# Altium schematic sheet pay-led-pcb.SchDoc: PAY-LED
size A4; DrawnBy: Lorna Lan; Organization: UTAT; DocumentNumber: PL01; Revision: 3; SheetNumber: 1; SheetTotal: 1
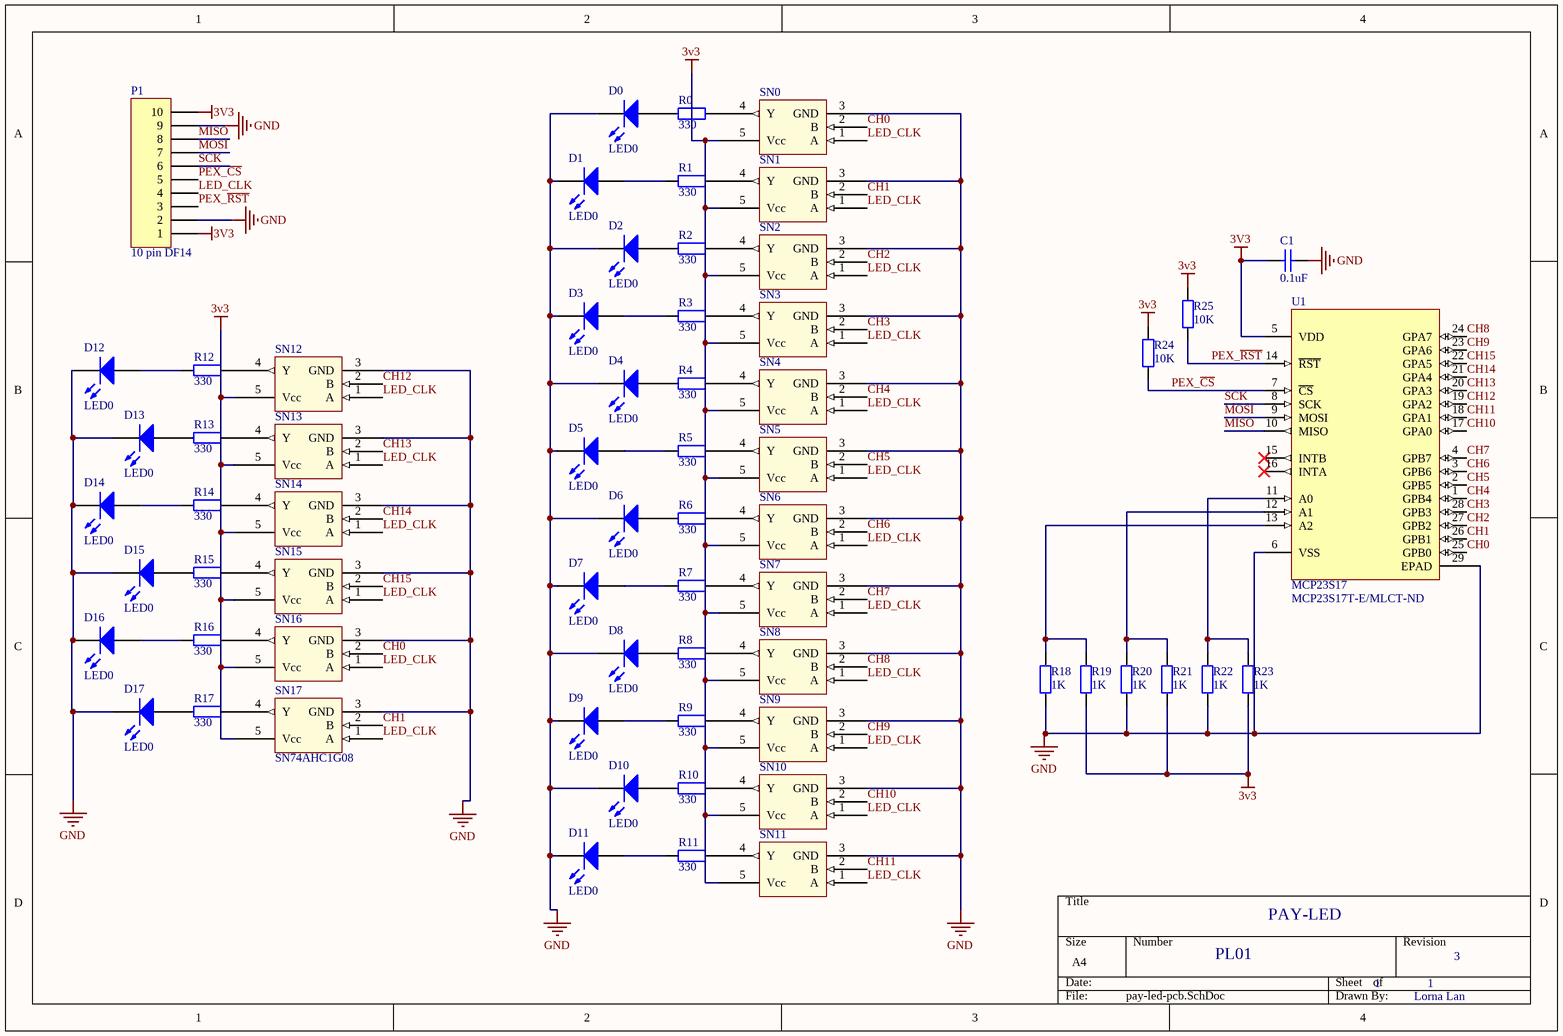
[diagram p0: pay-led-pcb.SchDoc]

## Parts
C1  0.1uF  [1608[0603]]
D0  LED0  [LB P4SG]
D1  LED0  [LB P4SG]
D2  LED0  [LB P4SG]
D3  LED0  [LB P4SG]
D4  LED0  [LB P4SG]
D5  LED0  [LB P4SG]
D6  LED0  [LB P4SG]
D7  LED0  [LB P4SG]
D8  LED0  [LB P4SG]
D9  LED0  [LB P4SG]
D10  LED0  [LB P4SG]
D11  LED0  [LB P4SG]
D12  LED0  [LB P4SG]
D13  LED0  [LB P4SG]
D14  LED0  [LB P4SG]
D15  LED0  [LB P4SG]
D16  LED0  [LB P4SG]
D17  LED0  [LB P4SG]
P1  10 pin DF14  [DF14-10P-1.25H(55)]
R0  330  [J1-0603]
R1  330  [J1-0603]
R2  330  [J1-0603]
R3  330  [J1-0603]
R4  330  [J1-0603]
R5  330  [J1-0603]
R6  330  [J1-0603]
R7  330  [J1-0603]
R8  330  [J1-0603]
R9  330  [J1-0603]
R10  330  [J1-0603]
R11  330  [J1-0603]
R12  330  [J1-0603]
R13  330  [J1-0603]
R14  330  [J1-0603]
R15  330  [J1-0603]
R16  330  [J1-0603]
R17  330  [J1-0603]
R18  1K  [J1-0603]
R19  1K  [J1-0603]
R20  1K  [J1-0603]
R21  1K  [J1-0603]
R22  1K  [J1-0603]
R23  1K  [J1-0603]
R24  10K  [J1-0603]
R25  10K  [J1-0603]
SN0  SN74AHC1G08  [SOT-23-5_95P290X160-5N]  (value not drawn)
SN1  SN74AHC1G08  [SOT-23-5_95P290X160-5N]  (value not drawn)
SN2  SN74AHC1G08  [SOT-23-5_95P290X160-5N]  (value not drawn)
SN3  SN74AHC1G08  [SOT-23-5_95P290X160-5N]  (value not drawn)
SN4  SN74AHC1G08  [SOT-23-5_95P290X160-5N]  (value not drawn)
SN5  SN74AHC1G08  [SOT-23-5_95P290X160-5N]  (value not drawn)
SN6  SN74AHC1G08  [SOT-23-5_95P290X160-5N]  (value not drawn)
SN7  SN74AHC1G08  [SOT-23-5_95P290X160-5N]  (value not drawn)
SN8  SN74AHC1G08  [SOT-23-5_95P290X160-5N]  (value not drawn)
SN9  SN74AHC1G08  [SOT-23-5_95P290X160-5N]  (value not drawn)
SN10  SN74AHC1G08  [SOT-23-5_95P290X160-5N]  (value not drawn)
SN11  SN74AHC1G08  [SOT-23-5_95P290X160-5N]  (value not drawn)
SN12  SN74AHC1G08  [SOT-23-5_95P290X160-5N]  (value not drawn)
SN13  SN74AHC1G08  [SOT-23-5_95P290X160-5N]  (value not drawn)
SN14  SN74AHC1G08  [SOT-23-5_95P290X160-5N]  (value not drawn)
SN15  SN74AHC1G08  [SOT-23-5_95P290X160-5N]  (value not drawn)
SN16  SN74AHC1G08  [SOT-23-5_95P290X160-5N]  (value not drawn)
SN17  SN74AHC1G08  [SOT-23-5_95P290X160-5N]
U1  MCP23S17  Supplier Part Number 1: MCP23S17T-E/MLCT-ND  [QFN65P600X600X100-29N]

## Nets
3v3: C1.2 P1.1 P1.10 R19.1 R21.1 R23.1 R24.1 R25.1 SN0.5(Vcc) SN1.5(Vcc) SN2.5(Vcc) SN3.5(Vcc) SN4.5(Vcc) SN5.5(Vcc) SN6.5(Vcc) SN7.5(Vcc) SN8.5(Vcc) SN9.5(Vcc) SN10.5(Vcc) SN11.5(Vcc) SN12.5(Vcc) SN13.5(Vcc) SN14.5(Vcc) SN15.5(Vcc) SN16.5(Vcc) SN17.5(Vcc) U1.5(VDD)
GND: C1.1 D0.2(K) D1.2(K) D2.2(K) D3.2(K) D4.2(K) D5.2(K) D6.2(K) D7.2(K) D8.2(K) D9.2(K) D10.2(K) D11.2(K) D12.2(K) D13.2(K) D14.2(K) D15.2(K) D16.2(K) D17.2(K) P1.2 P1.9 R18.1 R20.1 R22.1 SN0.3(GND) SN1.3(GND) SN2.3(GND) SN3.3(GND) SN4.3(GND) SN5.3(GND) SN6.3(GND) SN7.3(GND) SN8.3(GND) SN9.3(GND) SN10.3(GND) SN11.3(GND) SN12.3(GND) SN13.3(GND) SN14.3(GND) SN15.3(GND) SN16.3(GND) SN17.3(GND) U1.6(VSS) U1.29(EPAD)
CH0: SN0.2(B) SN16.2(B) U1.25(GPB0)
CH1: SN1.2(B) SN17.2(B) U1.26(GPB1)
CH2: SN2.2(B) U1.27(GPB2)
CH3: SN3.2(B) U1.28(GPB3)
CH4: SN4.2(B) U1.1(GPB4)
CH5: SN5.2(B) U1.2(GPB5)
CH6: SN6.2(B) U1.3(GPB6)
CH7: SN7.2(B) U1.4(GPB7)
CH8: SN8.2(B) U1.24(GPA7)
CH9: SN9.2(B) U1.23(GPA6)
CH10: SN10.2(B) U1.17(GPA0)
CH11: SN11.2(B) U1.18(GPA1)
CH12: SN12.2(B) U1.19(GPA2)
CH13: SN13.2(B) U1.20(GPA3)
CH14: SN14.2(B) U1.21(GPA4)
CH15: SN15.2(B) U1.22(GPA5)
LED_CLK: P1.4 SN0.1(A) SN1.1(A) SN2.1(A) SN3.1(A) SN4.1(A) SN5.1(A) SN6.1(A) SN7.1(A) SN8.1(A) SN9.1(A) SN10.1(A) SN11.1(A) SN12.1(A) SN13.1(A) SN14.1(A) SN15.1(A) SN16.1(A) SN17.1(A)
MISO: P1.8 U1.10(MISO)
MOSI: P1.7 U1.9(MOSI)
PEX_~{CS}: P1.5 R24.2 U1.7(~{CS})
PEX_~{RST}: P1.3 R25.2 U1.14(~{RST})
SCK: P1.6 U1.8(SCK)
NetD0_1: D0.1(A) R0.1
NetD1_1: D1.1(A) R1.1
NetD2_1: D2.1(A) R2.1
NetD3_1: D3.1(A) R3.1
NetD4_1: D4.1(A) R4.1
NetD5_1: D5.1(A) R5.1
NetD6_1: D6.1(A) R6.1
NetD7_1: D7.1(A) R7.1
NetD8_1: D8.1(A) R8.1
NetD9_1: D9.1(A) R9.1
NetD10_1: D10.1(A) R10.1
NetD11_1: D11.1(A) R11.1
NetD12_1: D12.1(A) R12.1
NetD13_1: D13.1(A) R13.1
NetD14_1: D14.1(A) R14.1
NetD15_1: D15.1(A) R15.1
NetD16_1: D16.1(A) R16.1
NetD17_1: D17.1(A) R17.1
NetR0_2: R0.2 SN0.4(Y)
NetR1_2: R1.2 SN1.4(Y)
NetR2_2: R2.2 SN2.4(Y)
NetR3_2: R3.2 SN3.4(Y)
NetR4_2: R4.2 SN4.4(Y)
NetR5_2: R5.2 SN5.4(Y)
NetR6_2: R6.2 SN6.4(Y)
NetR7_2: R7.2 SN7.4(Y)
NetR8_2: R8.2 SN8.4(Y)
NetR9_2: R9.2 SN9.4(Y)
NetR10_2: R10.2 SN10.4(Y)
NetR11_2: R11.2 SN11.4(Y)
NetR12_2: R12.2 SN12.4(Y)
NetR13_2: R13.2 SN13.4(Y)
NetR14_2: R14.2 SN14.4(Y)
NetR15_2: R15.2 SN15.4(Y)
NetR16_2: R16.2 SN16.4(Y)
NetR17_2: R17.2 SN17.4(Y)
NetR18_2: R18.2 R19.2 U1.13(A2)
NetR20_2: R20.2 R21.2 U1.12(A1)
NetR22_2: R22.2 R23.2 U1.11(A0)

Not connected (* = marked no-connect by the designer): U1 15(INTB)* 16(INTA)*

## Library data of the parts
C1 = Cap: Capacitor; Published: 8-Jun-2000; LatestRevisionDate: 17-Jul-2002; LatestRevisionNote: Re-released for DXP Platform.; PackageReference: RAD-0.3; Publisher: Altium Limited; PackageDescription: Radial Cap, Thru-Hole; 2 Leads; 0.3 in Pin Spacing; Value: 0.1uF; Supplier: Digi-Key; Supplier Part Number 1: 311-1341-1-ND
D0-D17 = LED0: Typical INFRARED GaAs LED; Published: 8-Jun-2000; LatestRevisionDate: 08-Jul-2005; LatestRevisionNote: Mech Layer 1 removed.; PackageReference: LED-0; Publisher: Altium Limited; PackageDescription: LED; 2 Leads; Supplier: Digi-Key; Supplier Part Number 1: 475-1316-1-ND
P1 = Header 10: Header, 10-Pin; LatestRevisionDate: 17-Jul-2002; LatestRevisionNote: Re-released for DXP Platform.; Publisher: Altium Limited; Supplier: Digi-Key; Supplier Part Number 1: H10329CT-ND
R0-R25 = Res2: Resistor; Published: 8-Jun-2000; LatestRevisionDate: 17-Jul-2002; LatestRevisionNote: Re-released for DXP Platform.; PackageReference: AXIAL-0.4; Publisher: Altium Limited; PackageDescription: Axial Device, Thru-Hole; 2 Leads; 0.4 in Pin Spacing; Supplier: Digi-Key
  R0-R17: Value: 330; Supplier Part Number 1: 1276-4604-1-ND
  R18-R23: Value: 1K; Supplier Part Number 1: RNCP0603FTD1K00CT-ND
  R24 R25: Value: 10K; Supplier Part Number 1: RMCF0603JG10K0CT-ND
U1 = MCP23S17: 16-bit I/O expander.; Supplier: Digi-Key
SN0-SN17 = SN74AHC1G08: Supplier: Digi-Key; Supplier Part Number 1: 296-23875-1-ND